# Altium schematic sheet storage.SchDoc
size A4; SheetNumber: 5; SheetTotal: 5
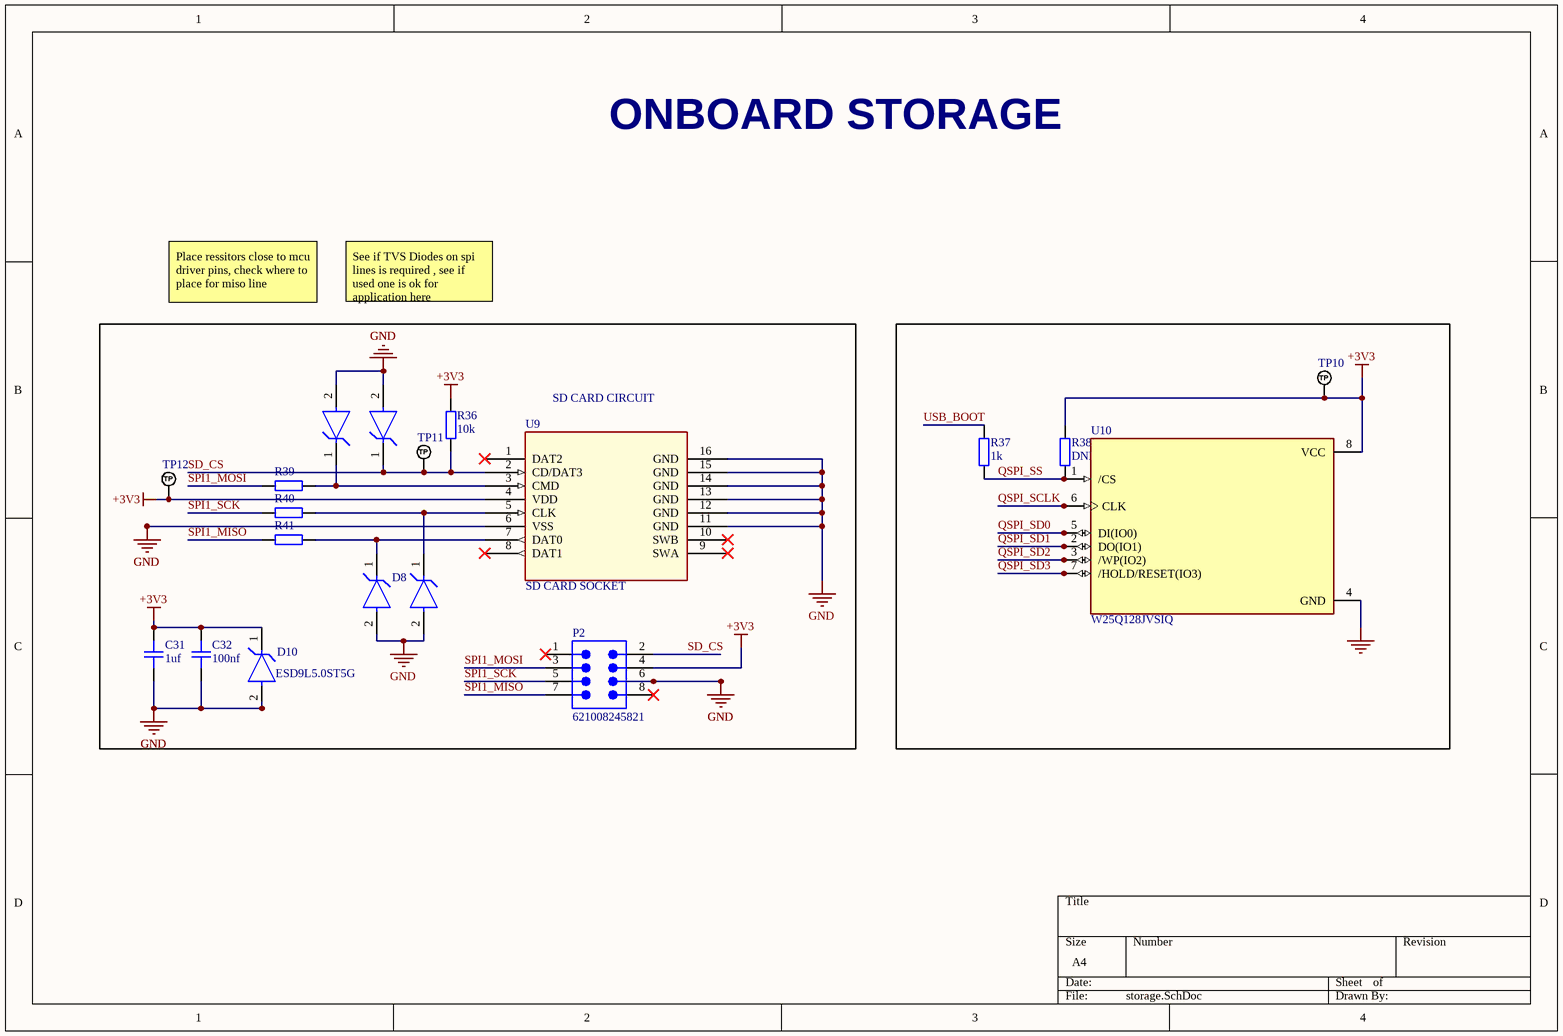
[diagram p0: storage.SchDoc]

## Parts
C31  1uf  [CAP_0805]
C32  100nf  [CAP_0402]
D6  ESD9L5.0ST5G  [On_Semiconductor_514AB_MFG]  (value not drawn)
D7  ESD9L5.0ST5G  [On_Semiconductor_514AB_MFG]  (value not drawn)
D8  ESD9L5.0ST5G  [On_Semiconductor_514AB_MFG]  (value not drawn)
D9  ESD9L5.0ST5G  [On_Semiconductor_514AB_MFG]  (value not drawn)
D10  ESD9L5.0ST5G  [On_Semiconductor_514AB_MFG]
P2  621008245821  [621008245821]
R36  10k  [RES_0603]
R37  1k  [RES_0402]
R38  DNF  [RES_0402]
R39  22 ohm  [RES_0603]  (value not drawn)
R40  22 ohm  [RES_0603]  (value not drawn)
R41  22 ohm  [RES_0603]  (value not drawn)
TP10  TEST_POINT_RND_1MM  [PAD_RND_1MM]  (value not drawn)  (no BOM)
TP11  TEST_POINT_RND_1MM  [PAD_RND_1MM]  (value not drawn)  (no BOM)
TP12  TEST_POINT_RND_1MM  [PAD_RND_1MM]  (value not drawn)  (no BOM)
U9  SD CARD SOCKET  [SD CARD SOCKET]
U10  W25Q128JVSIQ  [SOIC127P790X216-8N]

## Blocks framed on the sheet
SD CARD CIRCUIT: C31 C32 D6-D10 P2 R36 R39-R41 TP11 TP12 U9

## Nets
+3V3: C31.2 C32.2 D10.1(C) P2.4 R36.2 R38.2 TP10.1(TP) TP12.1(TP) U9.4(VDD) U10.8(VCC)
GND: C31.1 C32.1 D6.2(A) D7.2(A) D8.2(A) D9.2(A) D10.2(A) P2.6 U9.6(VSS) U9.11(GND) U9.12(GND) U9.13(GND) U9.14(GND) U9.15(GND) U9.16(GND) U10.4(GND)
QSPI_SCLK: U10.6(CLK)
QSPI_SD0: U10.5(DI(IO0))
QSPI_SD1: U10.2(DO(IO1))
QSPI_SD2: U10.3(/WP(IO2))
QSPI_SD3: U10.7(/HOLD/RESET(IO3))
QSPI_SS: R37.1 R38.1 U10.1(/CS)
SD_CS: D7.1(C) P2.2 R36.1 TP11.1(TP) U9.2(CD/DAT3)
SPI1_MISO: P2.7 R41.1
SPI1_MOSI: P2.3 R39.1
SPI1_SCK: P2.5 R40.1
USB_BOOT: R37.2
NetD6_1: D6.1(C) R39.2 U9.3(CMD)
NetD8_1: D8.1(C) R41.2 U9.7(DAT0)
NetD9_1: D9.1(C) R40.2 U9.5(CLK)

Not connected (* = marked no-connect by the designer): P2 1* 8*; U9 1(DAT2)* 8(DAT1)* 9(SWA)* 10(SWB)*

## Notes on the sheet
- ONBOARD STORAGE
- Place ressitors close to mcu driver pins, check where to place for miso line
- See if TVS Diodes on spi lines is required , see if used one is ok for application here

## Library data of the parts
C31 = CAP_0805: Capacitor SMD 0805; Manufacturer: *; Manufacturer Part Number: *; Distributor Link: *; LCSC: *; Rating: *; Dielectric: *
C32 = CAP_0402: Capacitor SMD 0402; Manufacturer: *; Manufacturer Part Number: *; Distributor Link: *; LCSC: *; Rating: *; Dielectric: *
D6-D10 = CMP-1063-00114-2: NexarPartId: 6987432; Manufacturer Lifecycle Status: ACTIVE; Polarity: Unidirectional; Max Surge Current: 1A; Reverse Standoff Voltage: 5V; ESD Protection: Yes; Capacitance: 500fF; Power Line Protection: No; Test Current: 1mA; Max Reverse Leakage Current: 1µA; Peak Pulse Power: 150mW; Clamping Voltage: 9.8V; Number of Unidirectional Channels: 1; Element Configuration: Single; Min Breakdown Voltage: 5.4V; Max Junction Temperature (Tj): 150°C; Reverse Breakdown Voltage: 5.8V; Length: 800µm; Min Operating Temperature: -55°C; Packaging: Tape and Reel; Width: 650µm; Height: 400µm; RoHS: Compliant; Number of Pins: 2; Lifecycle Status: Production; Schedule B: 8536300000; Operating Supply Voltage: 5V; Termination: SMD/SMT; Power Dissipation: 150mW; Direction: Unidirectional; Depth: 600µm; Composition: Zener; Lead Free: Lead Free; Contact Plating: Tin; Number of Lines: 1; Peak Pulse Current: 1A; REACH SVHC: No SVHC; Number of Channels: 1; Radiation Hardening: No; Number of Elements: 1; Max Operating Temperature: 150°C; Max Breakdown Voltage: 5.4V; Case/Package: SOD-923-2; Breakdown Voltage: 5.4V; Halogen Free: Halogen Free; Leakage Current: 1µA; Working Voltage: 5V
P2 = CMP-1502-00997-4: SMT Vertical Pin Header WR-PHD, Pitch 2.00 mm, Dual Row, 8 pins; Contact Resistance: 20mΩ; Current Rating: 2A; Operating Supply Voltage: 200V; Gender: Male; Number of Pins: 8; Orientation: Vertical; Lead Pitch: 2mm; RoHS: Non-Compliant
R36 R39-R41 = RES_0603: Resistor SMD 0603; Manufacturer: *; Manufacturer Part Number: *; Distributor Link: *; LCSC: *
R37 R38 = RES_0402: Resistor SMD 0402; Manufacturer: *; Manufacturer Part Number: *; Distributor Link: *; LCSC: *
TP10-TP12 = CMP-019-000001-1: Test Point Round 1mm (NO BOM); Design Item ID: TEST_POINT_RND_1MM; Source: Schematic-Lib-PhilsLab.SchLib
U10 = W25Q128JVSIQ: FLASH - NOR Memory IC 128Mb (16M x 8) SPI - Quad I/O, QPI, DTR 133 MHz 8-SOIC; MF: Winbond Electronics; SnapEDA_Link: https://www.snapeda.com/parts/W25Q128JVSIQ/Winbond/view-part/?ref=snap; Package: SOIC-8 Winbond Electronics; Value: *; MP: W25Q128JVSIQ; Check_prices: https://www.snapeda.com/parts/W25Q128JVSIQ/Winbond/view-part/?ref=eda